# Altium project stmProgrammer.PrjPcb
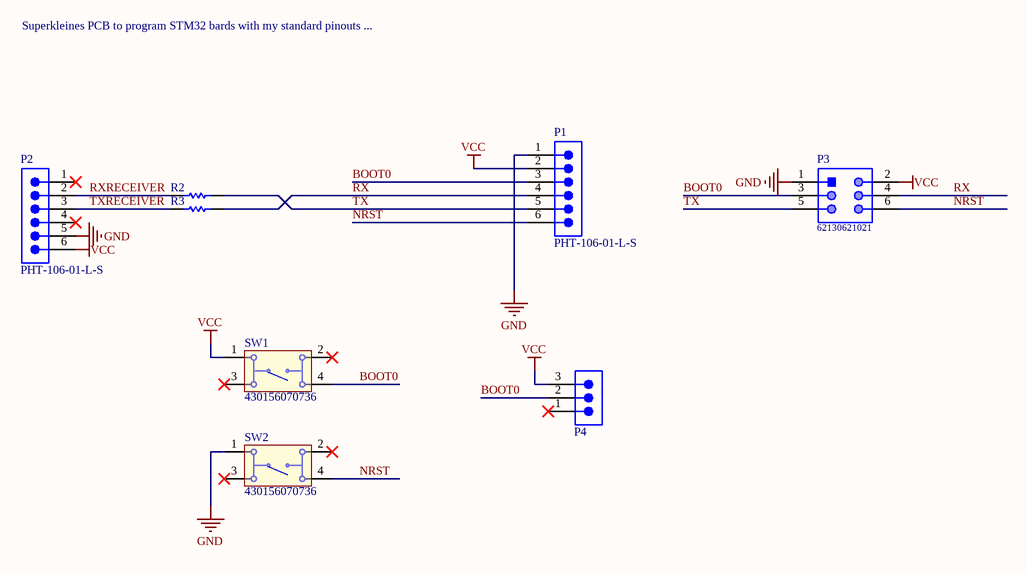
[diagram p0: main.SchDoc]
1 sheet, 8 parts. Net scope: global (net labels, ports and power ports of the same name join across sheets).
Board file: stmProgrammer.PcbDoc

## Sheet main.SchDoc
size A3

### Parts
P1  PHT-106-01-L-S  [SMTC-PHT-106-01-X-S]
P2  PHT-106-01-L-S  [SMTC-PHT-106-01-X-S]
P3  62130621021  [62130621021]
P4  TSW-103-07-F-S  [SMTC-TSW-103-07-X-S]  (value not drawn)
R2  0  [RESC0805(2012)_L]  (value not drawn)
R3  0  [RESC0805(2012)_L]  (value not drawn)
SW1  430156070736  [430156070736]
SW2  430156070736  [430156070736]

### Nets
GND: P1.1 P2.5 P3.1 SW2.1
VCC: P1.2 P2.6 P3.2 P4.3 SW1.1
BOOT0: P1.3 P3.3 P4.2 SW1.4
NRST: P1.6 P3.6 SW2.4
RX: P1.4 P3.4 R3.1
RXRECEIVER: P2.2 R2.2
TX: P1.5 P3.5 R2.1
TXRECEIVER: P2.3 R3.2

Not connected (* = marked no-connect by the designer): P2 1* 4*; P4 1*; SW1 2* 3*; SW2 2* 3*

### Notes on the sheet
- Superkleines PCB to program STM32 bards with my standard pinouts ...

### Library data of the parts
P1 P2 = CMP-1024-00187-1: Press Fit Header, Through-hole, Vertical, -55 to 125 degC, 2.54 mm Pitch, 6-Pin, Male, RoHS; Manufacturer: Samtec; Pitch: 2.54 mm; PackageReference: PHT-106-01-X-S; PackageDescription: .100 Press Fit Socket Assembly; ComponentLink3URL: http://www.samtec.com/documents/webfiles/cpdf/PHT-1XX-XX-X-X-XXX-MKT.pdf; PackageVersion: J, 9/2009; ComponentLink3Description: Package Specification; PartNumber: PHT-106-01-L-S; ComponentLink1Description: Manufacturer URL; Orientation: Vertical; Mounting Technology: Through-hole; ComponentLink1URL: http://www.samtec.com; ComponentLink2URL: http://www.samtec.com/documents/webfiles/pdf/pht.pdf; Temperature Range: -55 to 125 degC; RoHS: True; DatasheetVersion: F-214; ComponentLink2Description: Datasheet
P3 = CMP-1502-00936-1: SMT Vertical Pin Header WR-PHD, Pitch 1.27 mm, Dual Row, 6 pins; Manufacturer: Wurth Elektronik; Contact Resistance: 20mOhm; Pitch: 1.27mm; Pin Number: 6; Gender: Male; Rated Current: 1A; Withstanding Voltage: 500VAC; Working Voltage: 100VAC; Orientation: Vertical; Packaging: TapeandReel; Row Number: Dual; Mounting Technology: SMT; Part Number: 62130621021; Publisher: WurthElektronik; Manufacturer URL: http://www.we-online.de; Datasheet URL: https://katalog.we-online.de/em/datasheet/62130621021.pdf; Package Reference: 62130621021; Operating Temperature: -40to105degC
P4 = CMP-1024-00331-1: Manufacturer: Samtec; Pitch: 2.54 mm; DatasheetVersion: F-214; ComponentLink1Description: Manufacturer URL; ComponentLink3URL: http://www.samtec.com/documents/webfiles/cpdf/TSW-XXX-XX-XXX-X-XX-XXX-MKT.pdf; Mounting Technology: Through-hole; PackageDescription: .025[0.64] SQ. Post Terminal Strip Assembly; Temperature Range: -55 to 125 degC; ComponentLink3Description: Package Specification; Orientation: Vertical; PartNumber: TSW-103-07-F-S; RoHS: True; PackageVersion: DM, 8/1988; ComponentLink2Description: Datasheet; ComponentLink1URL: http://www.samtec.com; ComponentLink2URL: http://www.samtec.com/documents/webfiles/pdf/TSW_TH.PDF; PackageReference: TSW-103-07-X-S
R2 R3 = CMP-1013-00624-1: Case-Metric: 2012; Case-EIA: 0805; Value: 10200.00 Ohm; Tolerance: 1 %; Power: 0.125 W; Technology: SMT
SW1 SW2 = CMP-1453-00006-1: WS-TATV THT Tact Switch 6X6 mm; Manufacturer: Wuerth Elektronik; NoPins: 04; ComponentLink2URL: http://katalog.we-online.de/em/datasheet/4301x6.pdf; ComponentLink1Description: Manufacturer URL; PackageReference: 430156070736; ComponentLink2Description: Datasheet; PartNumber: 430156070736; ComponentLink1URL: http://www.we-online.com